# Altium schematic sheet Pneumatics.SchDoc: Solenoid Drivers
size A4; Engineer: Jason Zhou; SheetNumber: 3; SheetTotal: 5; projectidentifier: V5 Co-processor
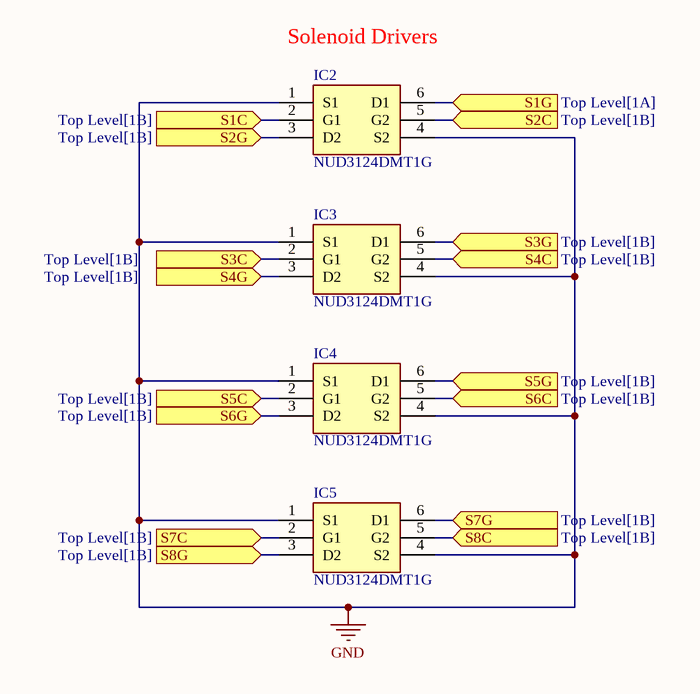
[diagram p0: Pneumatics.SchDoc]

## Parts
IC2  NUD3124DMT1G  [SOT95P275X110-6N]
IC3  NUD3124DMT1G  [SOT95P275X110-6N]
IC4  NUD3124DMT1G  [SOT95P275X110-6N]
IC5  NUD3124DMT1G  [SOT95P275X110-6N]

## Ports
S1C (in, see Top Level[1B]), S1G (in, see Top Level[1A]), S2C (in, see Top Level[1B]), S2G (in, see Top Level[1B]), S3C (in, see Top Level[1B]), S3G (in, see Top Level[1B]), S4C (in, see Top Level[1B]), S4G (in, see Top Level[1B]), S5C (in, see Top Level[1B]), S5G (in, see Top Level[1B]), S6C (in, see Top Level[1B]), S6G (in, see Top Level[1B]), S7C (in, see Top Level[1B]), S7G (in, see Top Level[1B]), S8C (in, see Top Level[1B]), S8G (in, see Top Level[1B])

## Nets
GND: IC2.1(S1) IC2.4(S2) IC3.1(S1) IC3.4(S2) IC4.1(S1) IC4.4(S2) IC5.1(S1) IC5.4(S2)
S1C: IC2.2(G1) ; port S1C
S1G: IC2.6(D1) ; port S1G
S2C: IC2.5(G2) ; port S2C
S2G: IC2.3(D2) ; port S2G
S3C: IC3.2(G1) ; port S3C
S3G: IC3.6(D1) ; port S3G
S4C: IC3.5(G2) ; port S4C
S4G: IC3.3(D2) ; port S4G
S5C: IC4.2(G1) ; port S5C
S5G: IC4.6(D1) ; port S5G
S6C: IC4.5(G2) ; port S6C
S6G: IC4.3(D2) ; port S6G
S7C: IC5.2(G1) ; port S7C
S7G: IC5.6(D1) ; port S7G
S8C: IC5.5(G2) ; port S8C
S8G: IC5.3(D2) ; port S8G

## Notes on the sheet
- (near IC2) Solenoid Drivers
- Size:
- Date:
- Title
- A4
- Project:
- Time:
- Revision:
- Sheet
- of
- Engineer
- File:

## Library data of the parts
IC2-IC5 = NUD3124DMT1G: Integrated Circuit; Manufacturer_Name: onsemi; Datasheet Link: http://www.onsemi.com/pub/Collateral/NUD3124-D.PDF; Height: 1.1mm; Manufacturer_Part_Number: NUD3124DMT1G; Mouser Part Number: 863-NUD3124DMT1G; Mouser Price/Stock: https://www.mouser.co.uk/ProductDetail/onsemi/NUD3124DMT1G?qs=ZXBb0xZ9WeDtXMbpPTBW4g%3D%3D; Arrow Part Number: NUD3124DMT1G; Arrow Price/Stock: https://www.arrow.com/en/products/nud3124dmt1g/on-semiconductor?region=nac